# EAGLE schematic SARA (EAGLE 9.3.0)
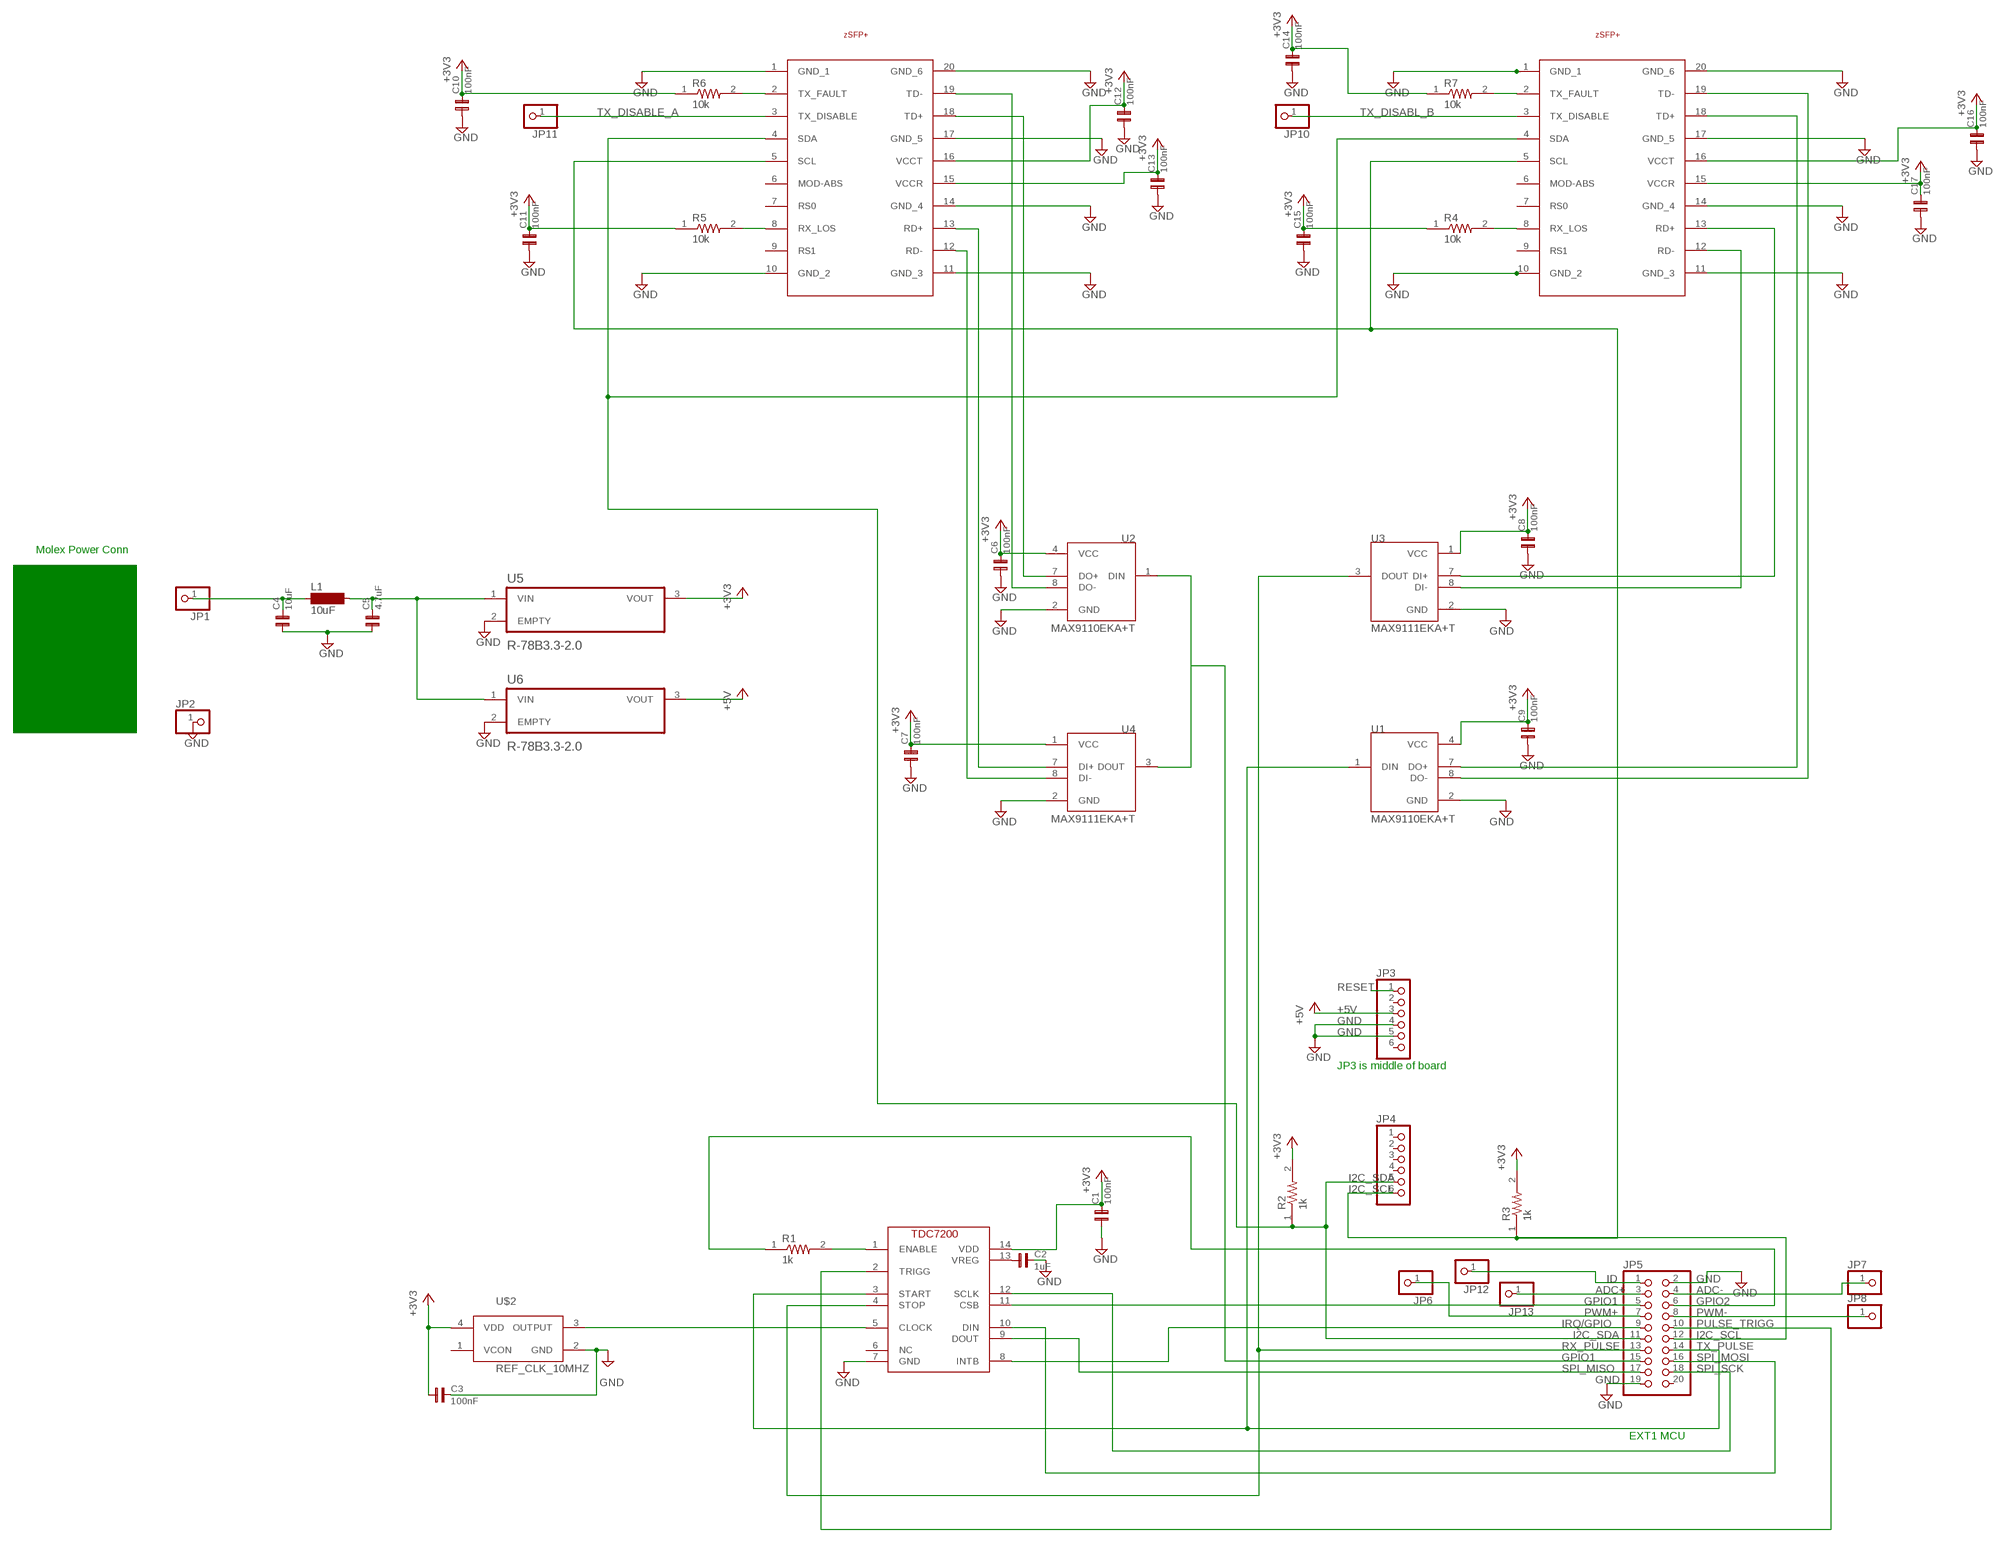
[diagram p0: schematic, sheet 1]

## Parts
C1  100nF  C0603  [0603]
C2  1uF  C0603  [0603]
C3  100nF  C0603  [0603]
C4  10uF  C0603  [0603]
C5  4.7uF  C0603  [0603]
C6  100nF  C0603  [0603]
C7  100nF  C0603  [0603]
C8  100nF  C0603  [0603]
C9  100nF  C0603  [0603]
C10  100nF  C0603  [0603]
C11  100nF  C0603  [0603]
C12  100nF  C0603  [0603]
C13  100nF  C0603  [0603]
C14  100nF  C0603  [0603]
C15  100nF  C0603  [0603]
C16  100nF  C0603  [0603]
C17  100nF  C0603  [0603]
JP1  PINHD-1X1  [1X01]
JP2  PINHD-1X1  [1X01]
JP3  PINHD-1X6  [1X06]
JP4  PINHD-1X6  [1X06]
JP5  PINHD-2X10  [2X10]
JP6  PINHD-1X1  [1X01]
JP7  PINHD-1X1  [1X01]
JP8  PINHD-1X1  [1X01]
JP10  PINHD-1X1  [1X01]
JP11  PINHD-1X1  [1X01]
JP12  PINHD-1X1  [1X01]
JP13  PINHD-1X1  [1X01]
L1  10uF  MS50  [MS50]
R1  1k  RES_0603  [RESC1608X55]
R2  1k  RES_0603  [RESC1608X55]
R3  1k  RES_0603  [RESC1608X55]
R4  10k  RES_0603  [RESC1608X55]
R5  10k  RES_0603  [RESC1608X55]
R6  10k  RES_0603  [RESC1608X55]
R7  10k  RES_0603  [RESC1608X55]
U1  MAX9110EKA+T  [SOT65P280X145-8N]
U2  MAX9110EKA+T  [SOT65P280X145-8N]
U3  MAX9111EKA+T  [SOT65P280X145-8N]
U4  MAX9111EKA+T  [SOT65P280X145-8N]
U5  R-78B3.3-2.0  [CONV_R-78B15-2.0]
U6  R-78B3.3-2.0  [CONV_R-78B15-2.0]
U$1  TDC72007201PW  [SOP65P640X120-14N]
U$2  REF_CLK_10MHZ  [TWETMCJANF-10.000000]
U$3  ZSFP+  [ZSFP+]
U$4  ZSFP+  [ZSFP+]

## Nets
+3V1: C9.2 U1.4(VCC) ; supply symbol labelled +3V3
+3V2: C10.2 C11.2 C12.2 C13.2 C14.2 C15.2 C16.2 C17.2 R4.1 R5.1 R6.1 R7.1 U$3.15(VCCR) U$3.16(VCCT) U$4.15(VCCR) U$4.16(VCCT) ; supply symbol labelled +3V3
+3V3: C1.2 C3.1 C6.2 C7.2 C8.2 R2.2 R3.2 U2.4(VCC) U3.1(VCC) U4.1(VCC) U5.3(VOUT) U$1.14(VDD) U$2.4(VDD)
+5V: JP3.3 U6.3(VOUT)
ADC+: JP5.3 JP13.1
ADC-: JP5.4 JP7.1
GND: C1.1 C2.2 C3.2 C4.1 C5.1 C6.1 C7.1 C8.1 C9.1 C10.1 C11.1 C12.1 C13.1 C14.1 C15.1 C16.1 C17.1 JP2.1 JP3.4 JP3.5 JP5.2 JP5.19 U1.2(GND) U2.2(GND) U3.2(GND) U4.2(GND) U5.2(EMPTY) U6.2(EMPTY) U$1.7(GND) U$2.2(GND) U$3.1(GND_1) U$3.10(GND_2) U$3.11(GND_3) U$3.14(GND_4) U$3.17(GND_5) U$3.20(GND_6) U$4.1(GND_1) U$4.11(GND_3) U$4.14(GND_4) U$4.17(GND_5) U$4.20(GND_6)
GPIO1: JP5.5 U$1.11(CSB)
GPIO2: JP5.6 R1.1
I2C_SCL: JP4.6 JP5.12 R3.1 U$3.5(SCL) U$4.5(SCL)
I2C_SDA: JP4.5 JP5.11 R2.1 U$3.4(SDA) U$4.4(SDA)
ID: JP5.1 JP12.1
IRQ/GPIO: JP5.9 U$1.8(INTB)
N$1: R4.2 U$4.8(RX_LOS)
N$2: R1.2 U$1.1(ENABLE)
N$3: JP5.15
N$4: C2.1 U$1.13(VREG)
N$6: U$1.5(CLOCK) U$2.3(OUTPUT)
N$7: U$4.10(GND_2) ; supply symbol labelled GND
N$9: C5.2 L1.2 U5.1(VIN) U6.1(VIN)
N$10: U1.7(DO+) U$4.18(TD+)
N$11: U4.7(DI+) U$3.13(RD+)
N$12: U4.8(DI-) U$3.12(RD-)
N$13: U2.8(DO-) U$3.19(TD-)
N$14: U2.7(DO+) U$3.18(TD+)
N$15: U3.7(DI+) U$4.13(RD+)
N$16: U3.8(DI-) U$4.12(RD-)
N$17: U1.8(DO-) U$4.19(TD-)
N$18: U2.1(DIN) U4.3(DOUT)
N$19: R5.2 U$3.8(RX_LOS)
N$20: R6.2 U$3.2(TX_FAULT)
N$21: R7.2 U$4.2(TX_FAULT)
N$22: C4.2 JP1.1 L1.1
PULSE_TRIGG: JP5.10 U$1.2(TRIGG)
PWM+: JP5.7 JP6.1
PWM-: JP5.8 JP8.1
RESET: JP3.1
RX_PULSE: JP5.13 U3.3(DOUT) U$1.4(STOP)
SPI_MISO: JP5.17 U$1.9(DOUT)
SPI_MOSI: JP5.16 U$1.10(DIN)
SPI_SCK: JP5.18 U$1.12(SCLK)
TX_DISABL_B: JP10.1 U$4.3(TX_DISABLE)
TX_DISABLE_A: JP11.1 U$3.3(TX_DISABLE)
TX_PULSE: JP5.14 U1.1(DIN) U$1.3(START)
Unconnected: JP3.2 JP3.6 JP4.1 JP4.2 JP4.3 JP4.4 JP5.20 U$1.6(NC) U$2.1(VCON) U$3.6(MOD-ABS) U$3.7(RS0) U$3.9(RS1) U$4.6(MOD-ABS) U$4.7(RS0) U$4.9(RS1)

## Notes on the sheet
- Molex Power Conn
- Molex Power Conn | Molex Power Conn
- JP3 is middle of board
- EXT1 MCU

## Library data of the parts
C1-C17 = capsmd:C0603
JP1 JP2 JP6-JP8 JP10-JP13 = pinhead:PINHD-1X1: PIN HEADER
JP3 JP4 = pinhead:PINHD-1X6: PIN HEADER
JP5 = pinhead:PINHD-2X10: PIN HEADER
L1 = inductor-neosid:MS50: INDUCTOR SMD power inductor; OC_FARNELL: unknown; OC_NEWARK: unknown
R1-R7 = RES_0603:RES_0603; AVAILABILITY: Unavailable; DESCRIPTION: Res Smd 0.047 Ohm 1% 0.4w 0603; MF: Vishay Dale; MP: WSLP0603R0470FEB; PACKAGE: 0603 Vishay Dale; PRICE: None
U1 U2 = MAX9110EKA_T:MAX9110EKA+T: The MAX9110 is a single LVDS transmitter; AVAILABILITY: Unavailable; DESCRIPTION: Single/Dual Lvds Line Driver With u; MF: Maxim Integrated; MP: MAX9110EKA+T; PACKAGE: SOT-23 Maxim Integrated; PRICE: None
U3 U4 = MAX9111EKA_T:MAX9111EKA+T
U5 U6 = R-78B3.3-2.0:R-78B3.3-2.0: None; AVAILABILITY: Unavailable; DESCRIPTION: Switching Regulator 4.75-32Vin 3.3Vo 2A; MF: Recom Power; MP: R-78B3.3-2.0; PACKAGE: SIP-3 Recom Power; PRICE: None
U$1 = TDC7200:TDC7200: TDC7200 chip made by Joe
U$2 = Ref_Clk:REF_CLK_10MHZ
U$3 U$4 = zSFP+:ZSFP+